# EAGLE design L6726a-5v (EAGLE 7.3.0)
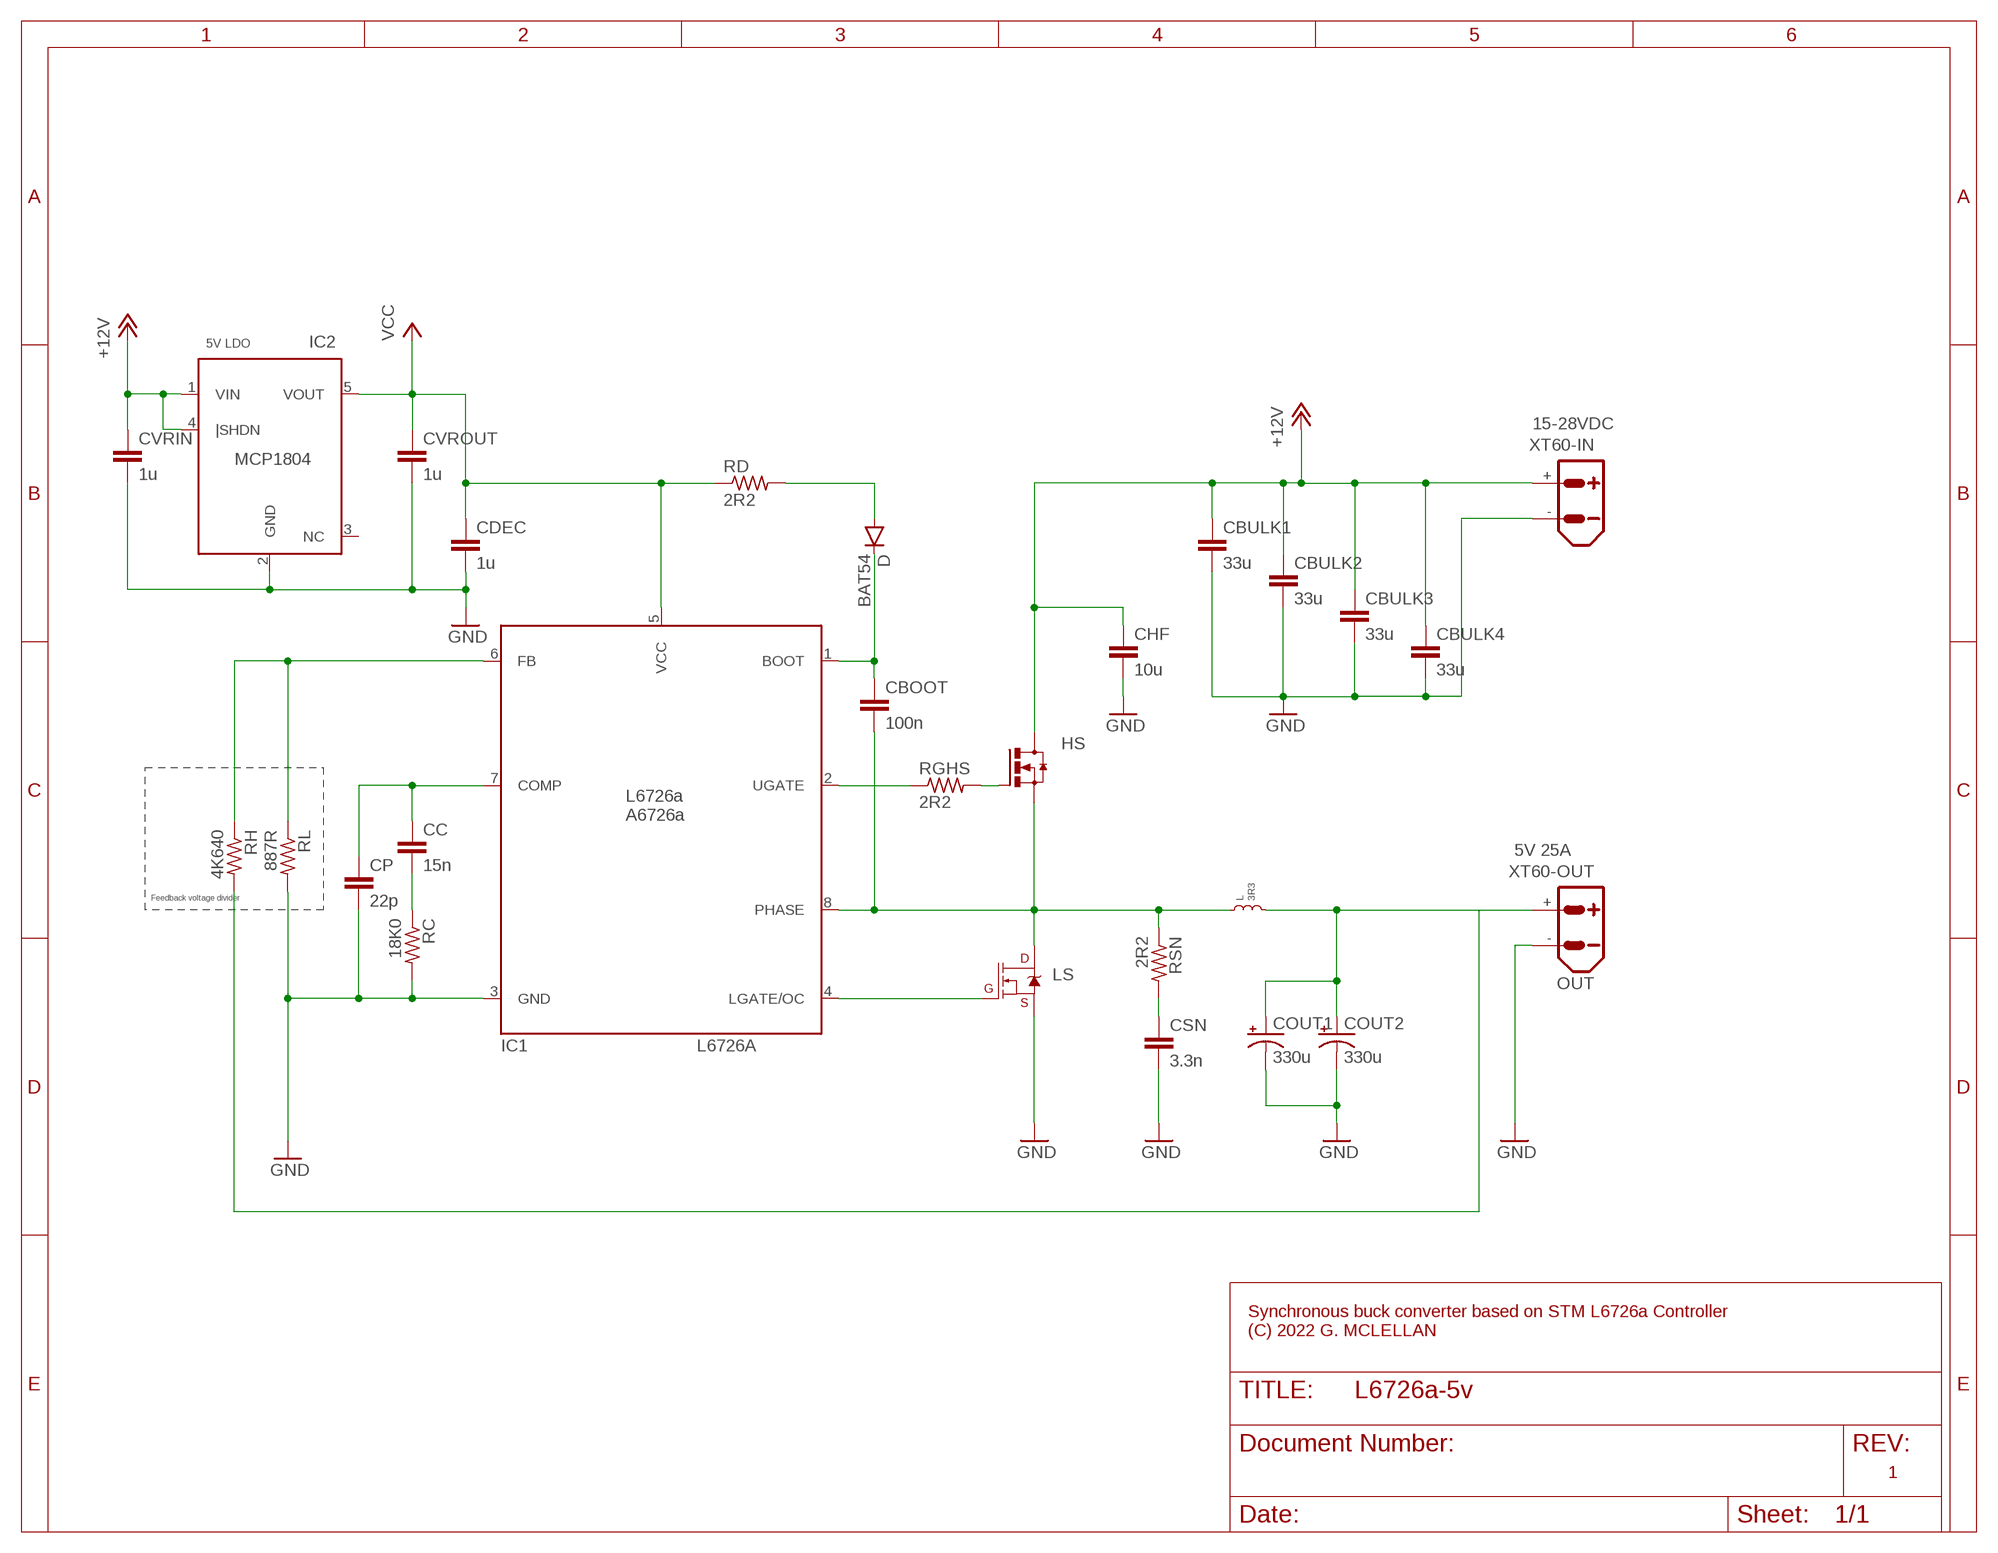
[diagram p0: schematic, sheet 1]

## Parts
CBOOT  100n  C-EUC0805  [C0805]
CBULK1  33u  C-EUC2220K  [C2220K]
CBULK2  33u  C-EUC2220K  [C2220K]
CBULK3  33u  C-EUC2220K  [C2220K]
CBULK4  33u  C-EUC2220K  [C2220K]
CC  15n  C-EUC0603  [C0603]
CDEC  1u  C-EUC0603  [C0603]
CHF  10u  C-EUC1206  [C1206]
COUT1  330u  CPOL-USSANYO_SMD_C6  [SANYO-OSCON_SMD_C6]
COUT2  330u  CPOL-USSANYO_SMD_C6  [SANYO-OSCON_SMD_C6]
CP  22p  C-EUC0603  [C0603]
CSN  3.3n  C-EUC0603  [C0603]
CVRIN  1u  C-EUC0603  [C0603]
CVROUT  1u  C-EUC0603  [C0603]
D  BAT54  DIODESOD123  [SOD-123]
HS  N_MOSFET_POWERSO8  [POWERSO8]
IC1  L6726A  [SO-08]
IC2  MCP1804  [SOT23-5]
L  3R3  INDUCTOR.XAL1010  [XAL1010]
LS  MOSFET-NCH-FDS6630A  [SO08]
RC  18K0  R-US_R0603  [R0603]
RD  2R2  R-US_R0603  [R0603]
RGHS  2R2  R-US_R0805  [R0805]
RH  4K640  R-US_R0805  [R0805]
RL  887R  R-US_R0805  [R0805]
RSN  2R2  R-US_R0603  [R0603]
XT60-IN  XT60PW-M  [XT60PW-M]
XT60-OUT  OUT  XT60PW-M  [XT60PW-M]

## Nets
+12V: CBULK1.1 CBULK2.1 CBULK3.1 CBULK4.1 CHF.1 CVRIN.1 HS.5(D) HS.6(D) HS.7(D) HS.8(D) HS.PAD(D) IC2.1(VIN) IC2.4(|SHDN) XT60-IN.+
BOOT: CBOOT.1 D.C IC1.1(BOOT)
CC: CC.2 RC.1
COMP: CC.1 CP.1 IC1.7(COMP)
FB: IC1.6(FB) RH.1 RL.1
GND: CBULK1.2 CBULK2.2 CBULK3.2 CBULK4.2 CDEC.2 CHF.2 COUT1.- COUT2.- CP.2 CSN.2 CVRIN.2 CVROUT.2 IC1.3(GND) IC2.2(GND) LS.1(S) LS.2(S) LS.3(S) RC.2 RL.2 XT60-IN.- XT60-OUT.-
LGATE: IC1.4(LGATE/OC) LS.4(G)
N$1: D.A RD.2
PHASE: CBOOT.2 HS.1(S) HS.2(S) HS.3(S) IC1.8(PHASE) L.P$1 LS.5(D) LS.6(D) LS.7(D) LS.8(D) RSN.1
RSN: CSN.1 RSN.2
UGATE: HS.4(G) RGHS.2
UGATE`: IC1.2(UGATE) RGHS.1
VCC: CDEC.1 CVROUT.1 IC1.5(VCC) IC2.5(VOUT) RD.1
VOUT: COUT1.+ COUT2.+ L.P$2 RH.2 XT60-OUT.+
Unconnected: IC2.3(NC)

## Notes on the sheet
- 5V LDO
- 15-28VDC
- 5V 25A
- Feedback voltage divider
- Synchronous buck converter based on STM L6726a Controller
  (C) 2022 G. MCLELLAN
- 1

## Library data of the parts
CBOOT CBULK1-CBULK4 CC CDEC CHF CP CSN CVRIN CVROUT = rcl:C-EU: CAPACITOR, European symbol
COUT1 COUT2 = rcl:CPOL-US: POLARIZED CAPACITOR, American symbol
D = SparkFun-DiscreteSemi:DIODE: Diode These are standard reverse protection diodes and small signal diodes. SMA package can handle up to about 1A. SOD-323 can handle about 200mA. What the SOD-323 package when ordering, there are some mfgs out there that are 5-pin packages.
HS = power-mosfet:N_MOSFET_POWERSO8
IC1 = stm-l6726a:L6726A: L6726A is a single-phase step-down controller with integrated high-current drivers that provides complete control logic, protections and reference voltage to realize in an easy and simple way general DC-DC converters by using a compact SO-8 package. Device flexibility allows managing conversions with power input VIN as low as 1.5 V and device supply voltage ranging from 5 V to 12 V
IC2 = microchip-vreg:MCP1804: The MCP1804 is a family of CMOS low dropout (LDO) voltage regulators that can deliver up to 150 mA of current while consuming only 50 µA of quiescent current (typical, 1.8V VOUT 5.0V). The input operating range is specified from 2.0V to 28.0V. The MCP1804 is capable of delivering 100 mA with only 1300 mV (typical) of input to output voltage differential (VOUT = 3.3V). The output voltage tolerance of the MCP1804 at +25°C is a maximum of ±2%. Line regulation is ±0.15% typical at +25°C.
L = coilcraft:INDUCTOR
LS = SparkFun-DiscreteSemi:MOSFET-NCH: N-channel MOSFETs Voltage controlled devices that allow control of high current outputs. SparkFun Products: SparkFun OpenScale <https://www.sparkfun.com/products/13261> SparkFun Digital Sandbox <https://www.sparkfun.com/products/12651> SparkFun Monster Moto Shield <https://www.sparkfun.com/products/10182> SparkFun MOSFET Power Controller <https://www.sparkfun.com/products/11214>; PROD_ID: TRANS-08089; VALUE: 6.5A/30V/38mΩ
RC RD RGHS RH RL RSN = rcl:R-US_: RESISTOR, American symbol
XT60-IN XT60-OUT = amass:XT60: AMASS XT60 connector Store in Japan AMASS XT60 connector <https://szc.jp/ams-xt60>

## Board
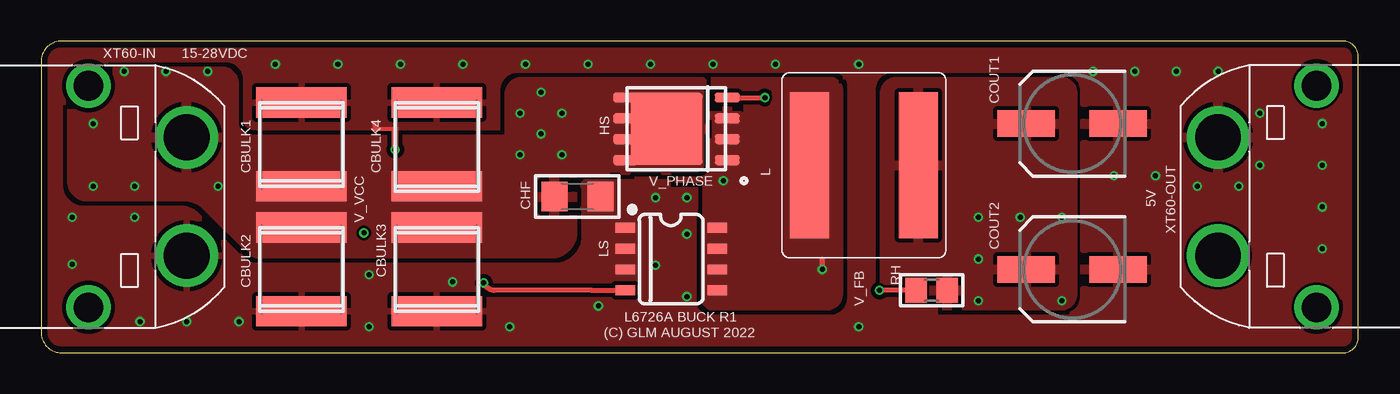
[diagram p1: board, top side]
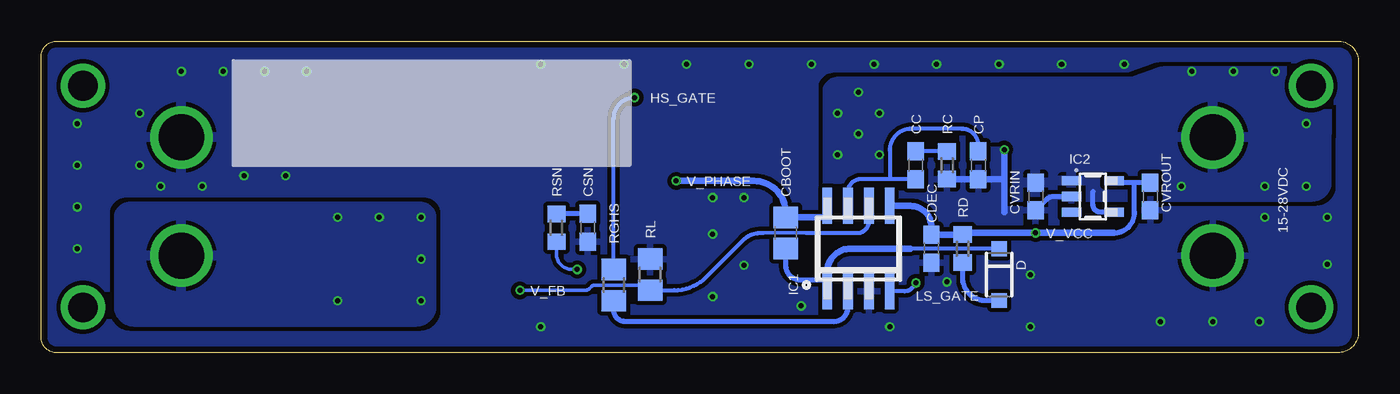
[diagram p2: board, bottom side, seen from below]

Size 80.31 x 19 mm. Coordinates in mm from the lower left corner, seen from the top.
Outline: 0,17.73 0,1.27 arc90 1.27,0 79.35,0 arc90 80.31,0.96 80.31,18.03 arc90 79.35,19 1.27,19 arc90 0,17.73
Copper layers (1*16): Top 0.035559375mm / dielectric 1.6mm / Bottom 0.035559375mm
Design rules "oshpark-2layer": minimum track width 6mil, minimum drill 10mil, track to track 6mil, track to pad 6mil, pad to pad 6mil, via to via 6mil, smd to smd 6mil, copper to edge 15mil, drill to drill 6mil, minimum pad ring 5mil, minimum via ring 5mil, stop-mask expansion 2.5mil, vias tented up to drill 0mil, thermal gap 10mil

### Footprints (pad centres in the part's own frame; a part is rotated, then mirrored left to right if it is on the bottom)
C0805 = smd 1.3 x 1.5: 1 -0.95,0; 2 0.95,0
C2220K = smd 1.85 x 5.5: 1 -2.55,0; 2 2.55,0
C0603 = smd 1.1 x 1: 1 -0.85,0; 2 0.85,0
C1206 = smd 1.6 x 1.8: 1 -1.4,0; 2 1.4,0
SANYO-OSCON_SMD_C6 = smd 3.5 x 1.6: + 2.8,0; - -2.8,0
SOD-123 = smd 0.9 x 0.95: A 1.575,0; C -1.575,0
POWERSO8 = smd 1.5 x 0.6: 1 -3.1,1.905; 2 -3.1,0.635; 3 -3.1,-0.635; 4 -3.1,-1.905; 5 3.1,-1.905; 6 3.1,-0.635; 7 3.1,0.635; 8 3.1,1.905 | smd 4.4 x 4.4: PAD 0.6,0
SO-08 = smd 0.6 x 2.2: 1 -1.905,-2.6; 2 -0.635,-2.6; 3 0.635,-2.6; 4 1.905,-2.6; 5 1.905,2.6; 6 0.635,2.6; 7 -0.635,2.6; 8 -1.905,2.6
SOT23-5 = smd 0.55 x 1.2: 1 -0.95,-1.3; 2 0,-1.3; 3 0.95,-1.3; 4 0.95,1.3; 5 -0.95,1.3
XAL1010 = smd 2.38 x 8.91: P$1 -3.325,0; P$2 3.325,0
SO08 = smd 0.6 x 1.2: 1 -1.905,-2.8; 2 -0.635,-2.8; 3 0.635,-2.8; 4 1.905,-2.8; 5 1.905,2.8; 6 0.635,2.8; 7 -0.635,2.8; 8 -1.905,2.8
R0603 = smd 1 x 1.1: 1 -0.85,0; 2 0.85,0
R0805 = smd 1.3 x 1.5: 1 -0.95,0; 2 0.95,0
XT60PW-M = drill 2.8: + 3.6,0; - -3.6,0 | drill 1.8: P$3 -6.75,6; P$4 6.75,6

### Placement (x,y rotation side)
CBOOT  34.93,7.3 90 bottom
CBULK1  15.87,12.7 90 top
CBULK2  15.87,5.08 270 top
CBULK3  24.13,5.08 270 top
CBULK4  24.13,12.7 90 top
CC  26.99,11.43 90 bottom
CDEC  26.03,6.35 270 bottom
CHF  32.7,9.53 0 top
COUT1  62.86,13.97 180 top
COUT2  62.86,5.08 180 top
CP  23.18,11.43 270 bottom
CSN  46.99,7.62 270 bottom
CVRIN  19.69,9.53 270 bottom
CVROUT  12.7,9.53 270 bottom
D  21.91,4.76 270 bottom
HS  38.73,13.65 180 top
IC1  30.48,6.35 0 bottom
IC2  16.19,9.53 270 bottom
L  50.16,11.43 0 top
LS  38.42,5.71 270 top
RC  25.08,11.43 270 bottom
RD  24.13,6.35 270 bottom
RGHS  45.4,4.13 90 bottom
RH  54.29,3.81 0 top
RL  43.18,4.76 90 bottom
RSN  48.9,7.62 90 bottom
XT60-IN  8.89,9.53 90 top
XT60-OUT  71.75,9.53 270 top

### Tracks (layer width: path | path; a pad name or v marks a point on that pad's centre or on a via)
+12V  (via drill 0.3)
  Bottom 0.305: IC2.4 15.74,8.57 arc90 16.19,9.02 16.19,9.84
  other vias: 29.21,12.06 31.75,12.06 30.48,15.88 10.16,17.14 7.62,17.14 5.08,17.14 3.18,13.97 3.18,10.16 5.71,10.16 10.79,10.16 29.21,14.61 31.75,14.61 30.48,13.34
  pour Top (isolate 0.254, rank 4): 8.78,9.53 2.8,9.53 arc-90 1.91,10.42 1.91,16.25 arc-90 2.8,17.14 11.04,17.14 arc-90 11.75,16.44 11.75,14.02 arc90 12.75,13.02 32.39,13.02 32.39,7.34 arc-90 31.08,6.03 13.43,6.03 arc-45 12.72,6.33 10.05,9 arc45
  pour Bottom (isolate 0.254, rank 4): 9.57,9.53 2.81,9.53 arc-90 1.93,10.4 1.91,16.24 arc-90 2.81,17.14 11.91,17.14 arc-20 12.21,17.09 13.56,16.6 arc45 13.78,16.51 31.75,16.51 arc-90 32.39,15.88 32.39,9.53 21.59,9.53 13.08,9.51
  pour Top (isolate 0.254, rank 2): 39.86,11.12 29.21,11.11 arc-90 28.58,11.75 28.58,15.8 arc-90 29.28,16.51 40.32,16.51 40.32,11.57 arc-91
  pour Top (isolate 0.254, rank 2, no thermals): 34.61,16.19 34.61,11.11 39.87,11.11 arc90 40.32,11.56 40.32,16.19
  pour Top (rank 3, no thermals): 12.7,6.35 12.7,10.72 arc-90 13.41,11.43 26.86,11.43 arc-90 27.3,10.98 27.3,6.35
BOOT
  Bottom 0.254: IC1.1 32.39,4.45 | D.C 27.3,6.35
  Bottom 0.305: CBOOT.1 34.93,5.34 arc-90 34.03,4.45 32.39,4.45
  Bottom 0.406: 27.3,6.35 30.97,6.35 arc-90 32.39,4.93 32.39,4.45
CC
  Bottom 0.254: RC.1 CC.2
COMP
  Bottom 0.203: 26.99,10.79 CC.1
  Bottom 0.254: CC.1 28.58,10.58 | 28.58,10.58 30.35,10.58 arc-90 31.12,9.82 IC1.7 | CP.1 23.18,12.65 arc-90 24.18,13.65 27.27,13.65 arc-90 28.58,12.34 28.58,10.58
FB  (via drill 0.3)
  Top 0.305: RH.1 v51.12,3.81
  Bottom 0.203: v51.12,3.81 47.12,3.81 arc-45 46.9,3.9 46.77,4.04 arc45 46.54,4.13 43.5,4.13 RL.1 | 36.29,7.3 33.66,7.3
  Bottom 0.254: RL.1 41.71,3.81 arc-45 39.75,4.62 37.48,6.89 arc45 36.49,7.3 36.29,7.3 | 33.66,7.3 30.55,7.3 arc-90 29.84,8.01 IC1.6
GND  (via drill 0.3)
  Top 0.254: 20.32,13.97 20.32,13.65 21.59,13.65
  Top 0.406: v21.59,12.38 21.59,13.65
  Bottom 0.254: v21.59,12.38 21.69,12.28
  Bottom 0.305: IC2.2 18.56,9.53 arc-45 19.03,9.33 CVRIN.2
  Bottom 0.406: 21.59,8.57 21.59,10.58 | 21.59,10.58 v21.59,12.38 | 21.59,10.58 CP.2 RC.2
  other vias: 64.14,17.14 65.41,10.79 67.95,10.79 66.67,17.14 1.91,5.4 1.91,8.26 5.71,8.26 6.03,1.91 8.89,1.91 28.58,1.59 33.97,2.86 37.47,9.46 14.29,17.58 18.1,17.58 21.91,17.58 25.72,17.58 29.53,17.58 33.34,17.58 37.15,17.58 40.96,17.58 20,1.59 12.06,1.91 25.08,4.32 44.77,17.58 49.85,17.58 39.37,9.46 69.22,17.14 71.75,17.14 70.48,10.16 73.03,10.16 74.3,11.43 78.11,11.43 78.11,13.97 74.3,14.61 78.11,8.89 78.11,6.35 49.85,1.59 20,4.76 37.47,5.33 39.37,3.43 39.37,7.24
  pour Top (rank 5): 62.86,2.69 62.86,17.14 arc-90 63.5,17.78 78.74,17.78 arc-90 79.38,17.14 79.38,1.91 arc-90 78.74,1.27 64.28,1.27 arc-90
  pour Bottom (rank 5): 56.52,10.16 56.52,17.14 arc-90 57.15,17.78 74.93,17.78 arc-90 75.56,17.14 75.56,10.16
  pour Bottom (isolate 0.254, rank 6): 0,19.05 80.64,19.05 80.64,0 0,0
  pour Top (isolate 0.254, rank 6): 0,19.05 80.64,19.05 80.64,0 0,0
  pour Top (isolate 0.254, rank 5, no thermals): 38.1,2.67 38.1,10.03 arc90 37.65,10.48 33.34,10.48 arc90 33.02,10.16 33.02,2.54 arc90 33.34,2.22 37.65,2.22 arc90
LGATE  (via drill 0.3)
  Top 0.305: v26.99,4.25 27.12,4.08 arc54 27.63,3.81 33.58,3.81 LS.4
  Bottom 0.254: 28.58,3.17 IC1.4 27.65,3.75 arc-53 27.19,3.98 v26.99,4.25
N$1
  Bottom 0.305: D.A 21.91,3.17 22.71,3.17 arc90 24.13,4.59 RD.2
PHASE  (via drill 0.3)
  Top 0.305: v47.62,5.08 47.62,5.71
  Bottom 0.203: RSN.1 48.9,6.03 arc-90 47.94,5.08 v47.62,5.08
  Bottom 0.305: 32.39,8.25 IC1.8 | 34.93,8.55 CBOOT.2
  Bottom 0.406: CBOOT.2 32.39,8.25 | v41.59,10.48 36.86,10.48 arc90 34.93,8.55
  pour Top (isolate 0.254, rank 4): 40.64,16.51 48.13,16.51 arc-90 48.58,16.06 48.58,3.57 arc-90 47.87,2.86 40.96,2.86 arc-90 40.64,3.17
  pour Top (isolate 0.254, rank 5, no thermals): 38.73,14.61 38.73,10.48 42.41,10.48 arc90 42.86,10.93 42.86,14.29 arc90 42.55,14.61
  pour Top (isolate 0.254, rank 4, no thermals): 42.86,2.86 42.86,8.12 arc90 42.41,8.57 40.77,8.57 arc90 40.32,8.12 40.32,3.31 arc90 40.77,2.86
  pour Top (rank 2, no thermals): 45.09,16.19 48.26,16.19 arc-90 48.58,15.88 48.58,7.3 arc-90 47.94,6.67 45.4,6.67 arc-90 44.77,7.3 44.77,15.88 arc-90
RSN
  Bottom 0.305: CSN.1 RSN.2
UGATE  (via drill 0.3)
  Top 0.305: HS.4 v44.13,15.56
  Bottom 0.254: RGHS.2 45.4,14.29 arc90 v44.13,15.56
UGATE`
  Bottom 0.305: IC1.2 31.12,2.8 arc90 32.01,1.91 44.69,1.91 arc90 45.4,2.62 RGHS.1
VCC  (via drill 0.3)
  Bottom 0.305: CVROUT.1 13.65,10.38 | 13.65,10.38 14.58,10.38 IC2.5 | 14.92,7.3 arc-90 13.65,8.57 13.65,10.38 | 26.03,7.68 CDEC.1 | 24.13,7.3 RD.1
  Bottom 0.406: 24.13,7.3 v19.69,7.3 19.05,7.3 14.92,7.3 | IC1.5 27.31,8.95 arc90 26.03,7.68 | RD.1 CDEC.1
VOUT  (via drill 0.3)
  other vias: 62.23,3.17 57.15,3.17 57.15,8.26 59.69,8.26 62.23,8.26 57.15,5.71
  pour Top (rank 4): 62.16,2.86 52.07,2.86 arc-90 51.44,3.49 51.44,15.8 arc-90 52.14,16.51 62.23,16.51 arc-90 62.86,15.88 62.86,3.57 arc-90
  pour Bottom (rank 4): 75.56,8.26 75.56,2.8 arc-90 74.67,1.91 57.41,1.91 arc-90 56.52,2.8 56.52,8.26 arc-90 57.15,8.89 74.93,8.89 arc-90

### Text on the board
tNames: 15-28VDC | V_PHASE | 5V | V_VCC | V_FB | L6726A BUCK R1 | (C) GLM AUGUST 2022
bNames: HS_GATE | V_PHASE | 15-28VDC | V_VCC | LS_GATE | V_FB